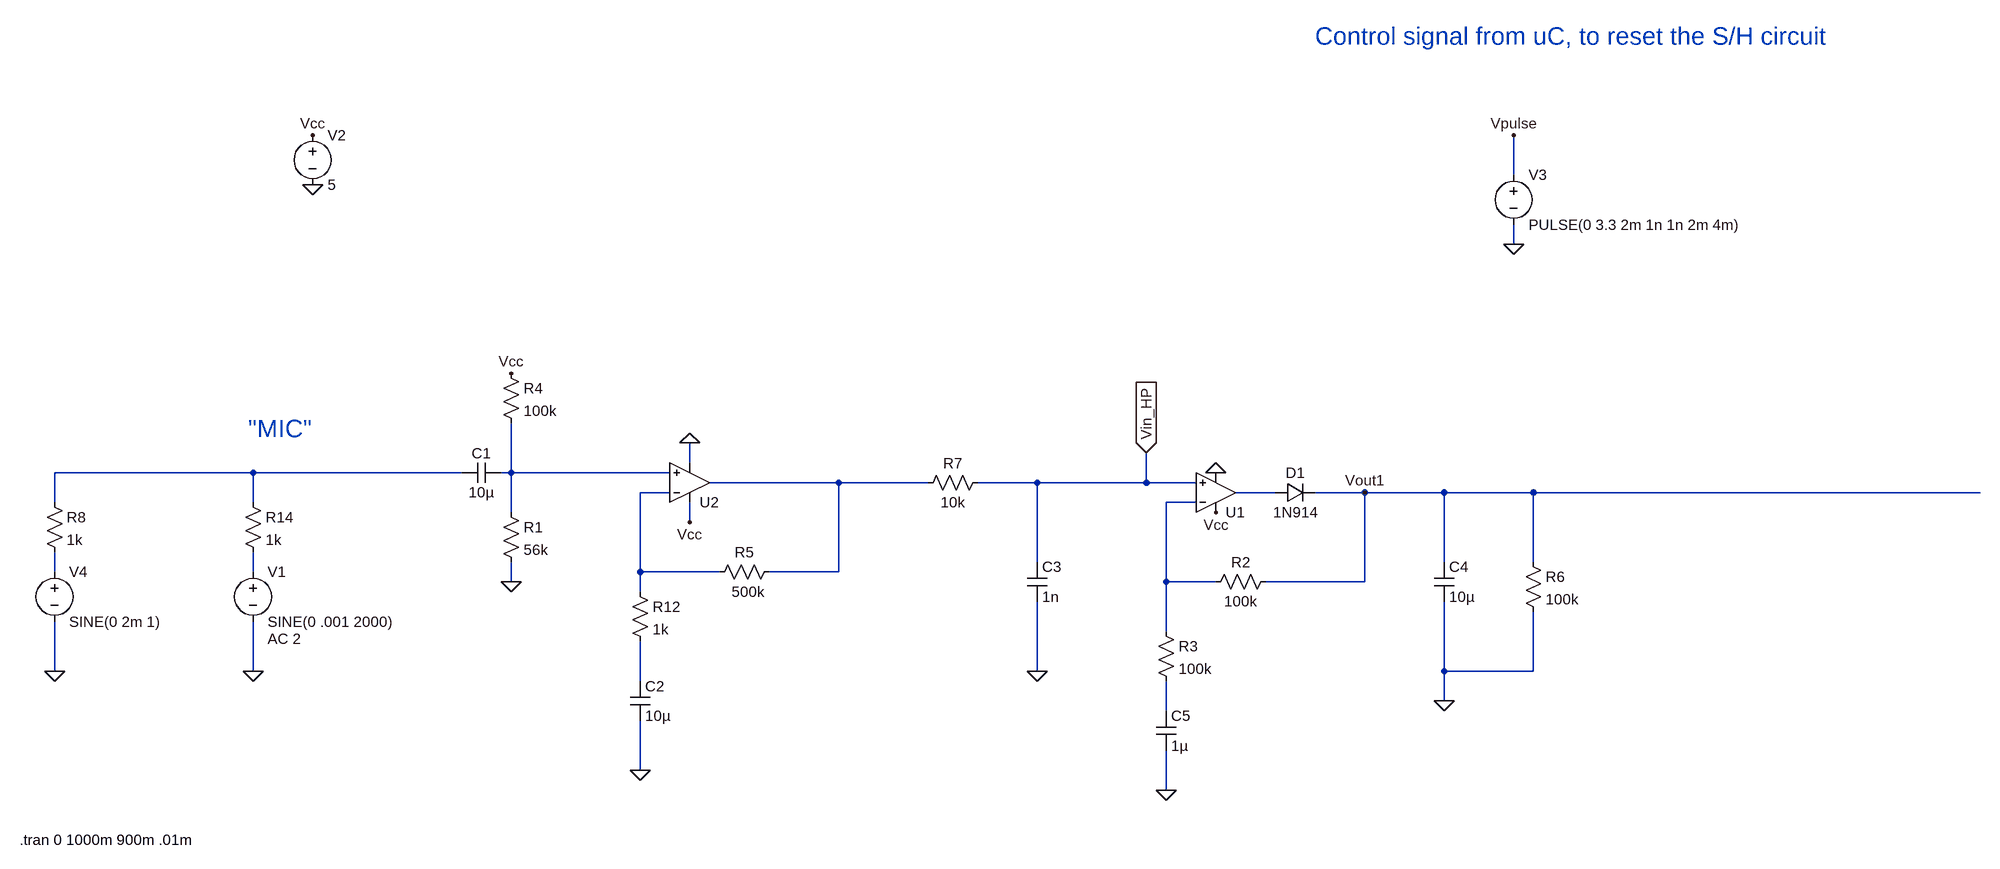
[diagram p0: schematic Audio peak detector with filter.asc]
Audio peak detector with filter.asc, the LTspice schematic file:
Version 4
SHEET 1 2988 1220
WIRE 1568 -336 1568 -400
WIRE 1568 -224 1568 -256
WIRE 240 128 240 96
WIRE -464 144 -784 144
WIRE -128 144 -464 144
WIRE -48 144 -48 64
WIRE -48 144 -64 144
WIRE 208 144 -48 144
WIRE 480 160 272 160
WIRE 624 160 480 160
WIRE 800 160 704 160
WIRE 976 160 976 112
WIRE 976 160 800 160
WIRE 1056 160 976 160
WIRE 208 176 160 176
WIRE 1184 176 1120 176
WIRE 1328 176 1248 176
WIRE 1456 176 1328 176
WIRE 1600 176 1456 176
WIRE 2320 176 1600 176
WIRE -784 192 -784 144
WIRE -464 192 -464 144
WIRE 1056 192 1008 192
WIRE -48 208 -48 144
WIRE 240 224 240 192
WIRE 800 288 800 160
WIRE 1456 288 1456 176
WIRE 1600 288 1600 176
WIRE -784 304 -784 272
WIRE -464 304 -464 272
WIRE 160 304 160 176
WIRE 288 304 160 304
WIRE 480 304 480 160
WIRE 480 304 368 304
WIRE -48 320 -48 288
WIRE 1008 320 1008 192
WIRE 1088 320 1008 320
WIRE 1328 320 1328 176
WIRE 1328 320 1168 320
WIRE 160 336 160 304
WIRE 1008 400 1008 320
WIRE -784 464 -784 384
WIRE -464 464 -464 384
WIRE 800 464 800 352
WIRE 1456 464 1456 352
WIRE 1600 464 1600 368
WIRE 1600 464 1456 464
WIRE 160 480 160 416
WIRE 1456 512 1456 464
WIRE 1008 528 1008 480
WIRE 160 624 160 544
WIRE 1008 656 1008 592
FLAG 1008 656 0
FLAG -48 320 0
FLAG -464 464 0
FLAG -368 -320 0
FLAG -368 -400 Vcc
FLAG -48 -16 Vcc
FLAG 1088 208 Vcc
FLAG 1088 144 0
FLAG 1328 176 Vout1
FLAG 240 224 Vcc
FLAG 240 96 0
FLAG 160 624 0
FLAG 1568 -224 0
FLAG 1568 -400 Vpulse
FLAG 976 112 Vin_HP
IOPIN 976 112 In
FLAG 1456 512 0
FLAG 800 464 0
FLAG -784 464 0
SYMBOL OpAmps\\UniversalOpAmp2 1088 176 M180
SYMATTR InstName U1
SYMBOL cap -64 128 R90
WINDOW 0 0 32 VBottom 2
WINDOW 3 32 32 VTop 2
SYMATTR InstName C1
SYMATTR Value 10µ
SYMBOL res -64 192 R0
SYMATTR InstName R1
SYMATTR Value 56k
SYMBOL res 1072 336 R270
WINDOW 0 32 56 VTop 2
WINDOW 3 0 56 VBottom 2
SYMATTR InstName R2
SYMATTR Value 100k
SYMBOL res 992 384 R0
SYMATTR InstName R3
SYMATTR Value 100k
SYMBOL res -64 -32 R0
SYMATTR InstName R4
SYMATTR Value 100k
SYMBOL voltage -464 288 R0
WINDOW 123 24 124 Left 2
WINDOW 39 0 0 Left 0
SYMATTR Value2 AC 2
SYMATTR InstName V1
SYMATTR Value SINE(0 .001 2000)
SYMBOL voltage -368 -416 R0
WINDOW 123 0 0 Left 0
WINDOW 39 0 0 Left 0
SYMATTR InstName V2
SYMATTR Value 5
SYMBOL OpAmps\\UniversalOpAmp2 240 160 M180
SYMATTR InstName U2
SYMBOL diode 1184 192 R270
WINDOW 0 32 32 VTop 2
WINDOW 3 0 32 VBottom 2
SYMATTR InstName D1
SYMATTR Value 1N914
SYMBOL cap 1440 288 R0
SYMATTR InstName C4
SYMATTR Value 10µ
SYMBOL res 144 320 R0
SYMATTR InstName R12
SYMATTR Value 1k
SYMBOL voltage 1568 -352 R0
WINDOW 123 0 0 Left 0
WINDOW 39 0 0 Left 0
SYMATTR InstName V3
SYMATTR Value PULSE(0 3.3 2m 1n 1n 2m 4m)
SYMBOL res -480 176 R0
SYMATTR InstName R14
SYMATTR Value 1k
SYMBOL res 384 288 R90
WINDOW 0 0 56 VBottom 2
WINDOW 3 32 50 VTop 2
SYMATTR InstName R5
SYMATTR Value 500k
SYMBOL cap 144 480 R0
SYMATTR InstName C2
SYMATTR Value 10µ
SYMBOL res 1584 272 R0
SYMATTR InstName R6
SYMATTR Value 100k
SYMBOL res 720 144 R90
WINDOW 0 0 56 VBottom 2
WINDOW 3 32 56 VTop 2
SYMATTR InstName R7
SYMATTR Value 10k
SYMBOL cap 784 288 R0
SYMATTR InstName C3
SYMATTR Value 1n
SYMBOL cap 992 528 R0
SYMATTR InstName C5
SYMATTR Value 1µ
SYMBOL voltage -784 288 R0
WINDOW 123 0 0 Left 0
WINDOW 39 0 0 Left 0
SYMATTR InstName V4
SYMATTR Value SINE(0 2m 1)
SYMBOL res -800 176 R0
SYMATTR InstName R8
SYMATTR Value 1k
TEXT -472 72 Left 4 ;"MIC"
TEXT 1248 -560 Left 4 ;Control signal from uC, to reset the S/H circuit
TEXT -840 736 Left 2 !.tran 0 1000m 900m .01m

The netlist it stands for:
* Audio peak detector with filter.asc
XU1 Vin_HP N006 Vcc 0 N005 level2 Avol=1Meg GBW=10Meg Slew=10Meg Ilimit=25m Rail=0 Vos=0 En=0 Enk=0 In=0 Ink=0 Rin=500Meg  ; pins In+ In- V+ V- OUT
C1 N002 N001 10µ
R1 N002 0 56k
R2 N006 Vout1 100k
R3 N006 N010 100k
R4 Vcc N002 100k
V1 N008 0 SINE(0 .001 2000) AC 2
V2 Vcc 0 5
XU2 N002 N004 Vcc 0 N003 level2 Avol=1Meg GBW=10Meg Slew=10Meg Ilimit=25m Rail=0 Vos=0 En=0 Enk=0 In=0 Ink=0 Rin=500Meg  ; pins In+ In- V+ V- OUT
D1 N005 Vout1 1N914
C4 Vout1 0 10µ
R12 N004 N009 1k
V3 Vpulse 0 PULSE(0 3.3 2m 1n 1n 2m 4m)
R14 N001 N008 1k
R5 N003 N004 500k
C2 N009 0 10µ
R6 Vout1 0 100k
R7 Vin_HP N003 10k
C3 Vin_HP 0 1n
C5 N010 0 1µ
V4 N007 0 SINE(0 2m 1)
R8 N001 N007 1k
.model D D
.lib standard.dio
* "MIC"
* Control signal from uC, to reset the S/H circuit
.tran 0 1000m 900m .01m
.lib UniversalOpAmp2.lib
.backanno
.end